# Altium schematic sheet 1.POWER.SchDoc
size A4
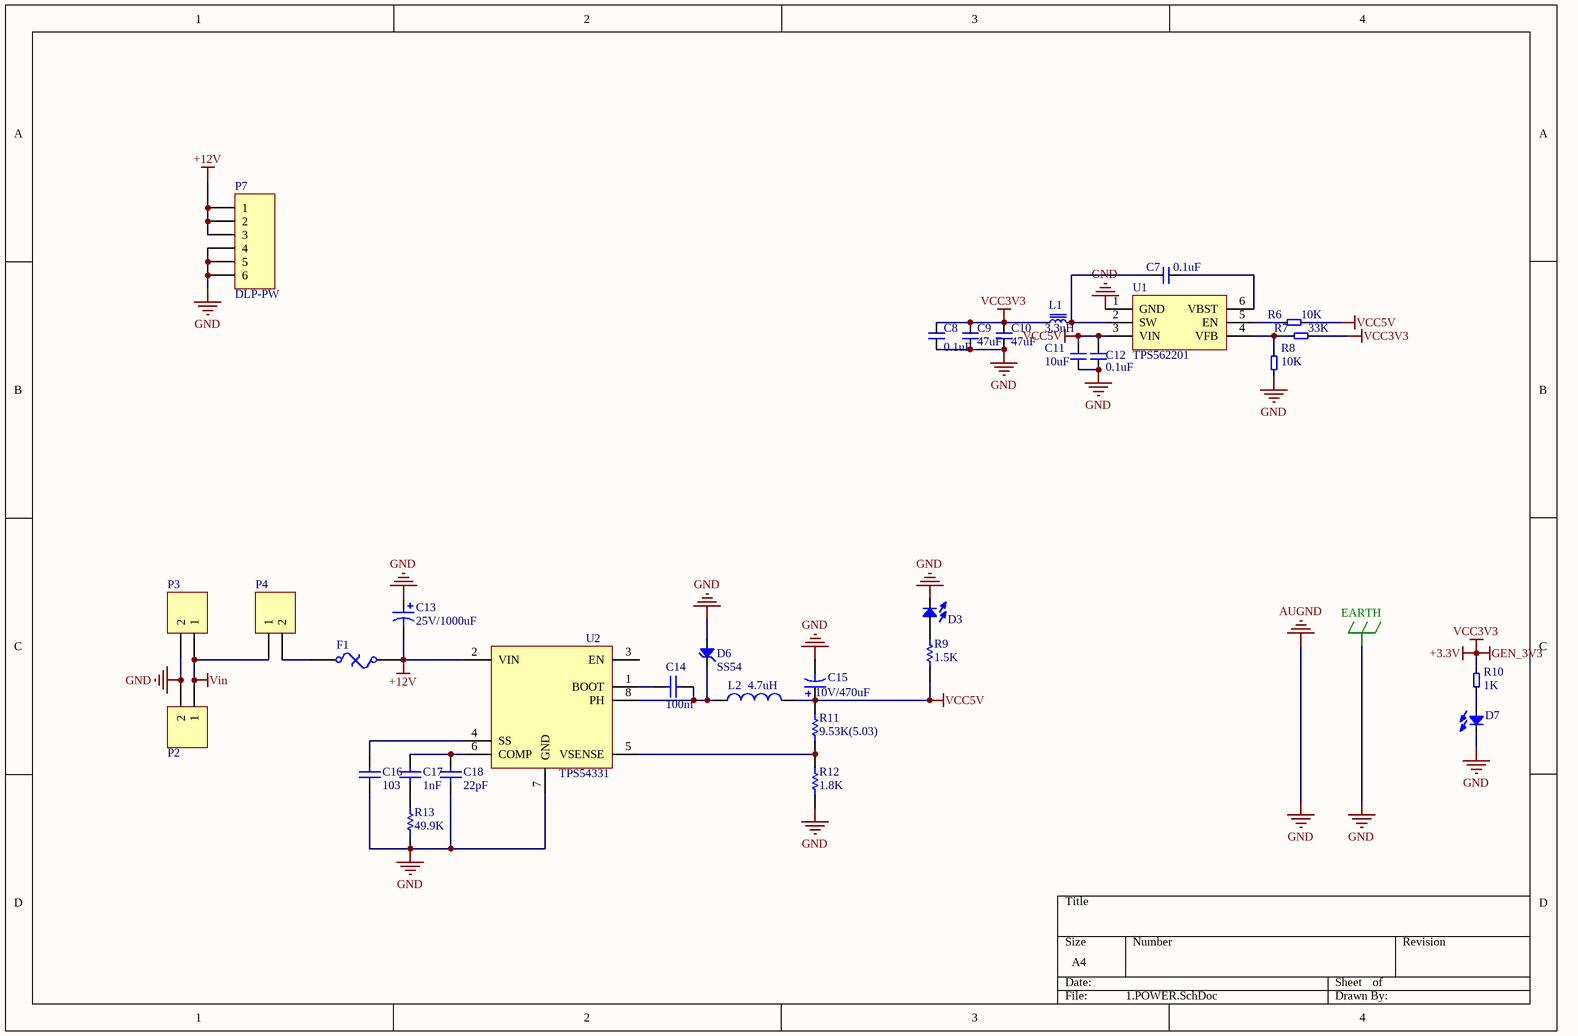
[diagram p0: 1.POWER.SchDoc]

## Parts
C7  0.1uF  [0603C]
C8  0.1uF  [0603C]
C9  47uF  [C1206]
C10  47uF  [C1206]
C11  10uF  [0603C]
C12  0.1uF  [0603C]
C13  value 25V/1000uF  [C10x5]  (hidden comment: Cap Pol3)
C14  value 100nf  [0603C]  (hidden comment: Cap)
C15  value 10V/470uF  [C8x4]  (hidden comment: Cap Pol3)
C16  value 103  [0603C]  (hidden comment: Cap)
C17  value 1nF  [0603C]  (hidden comment: Cap)
C18  value 22pF  [0603C]  (hidden comment: Cap)
D3  发光二极管  [0603D]  (value not drawn)
D6  SS54  [SMA]
D7  发光二极管  [0603D]  (value not drawn)
F1  Fuse Thermal  [1812F]  (value not drawn)
L1  3.3uH  [L4030]
L2  value 4.7uH  [L-6045]  (hidden comment: Inductor)
P2  Header 2  [XH2.54-2P]  (value not drawn)
P3  Header 2  [DC005]  (value not drawn)
P4  Header 2  [HDR1X2]  (value not drawn)
P7  DLP-PW  [SH1.0-6P]
R6  10K  [0603R]
R7  33K  [0603R]
R8  10K  [0603R]
R9  value 1.5K  [0603R]  (hidden comment: Res1)
R10  1K  [0603R]
R11  value 9.53K(5.03)  [0603R]  (hidden comment: Res Semi)
R12  value 1.8K  [0603R]  (hidden comment: Res Semi)
R13  value 49.9K  [0603R]  (hidden comment: Res Semi)
U1  TPS562201  [SOT23-6-DC]
U2  TPS54331  [SOP8-POW]

## Nets
+3.3V: C8.1 C9.1 C10.1 L1.1 R7.1 R10.2  [also labelled GEN_3V3, VCC3V3]
+12V: C13.2 F1.2 P7.1 P7.2 P7.3 U2.2(VIN)
AUGND: C8.2 C9.2 C10.2 C11.2 C12.2 C13.1 C15.2 C16.2 C18.1 D3.K D6.A D7.K P2.2 P3.2 P7.4 P7.5 P7.6 R8.1 R12.1 R13.1 U1.1(GND) U2.7(GND) U2.9(PAD)  [also labelled EARTH, GND]
VCC5V: C11.1 C12.1 C15.1 L2.2 R6.1 R9.1 R11.2 U1.3(VIN)
Vin: P2.1 P3.1 P4.1
NetC7_1: C7.1 L1.2 U1.2(SW)
NetC7_2: C7.2 U1.6(VBST)
NetC14_1: C14.1 D6.K L2.1 U2.8(PH)
NetC14_2: C14.2 U2.1(BOOT)
NetC16_1: C16.1 U2.4(SS)
NetC17_1: C17.1 R13.2
NetC17_2: C17.2 C18.2 U2.6(COMP)
NetD3_A: D3.A R9.2
NetD7_A: D7.A R10.1
NetF1_1: F1.1 P4.2
NetR6_2: R6.2 U1.5(EN)
NetR7_2: R7.2 R8.2 U1.4(VFB)
NetR11_1: R11.1 R12.2 U2.5(VSENSE)

Not connected (* = marked no-connect by the designer): U2 3(EN)

## Library data of the parts
C7-C12 = 电容
C13 C15 = Cap Pol3: Polarized Capacitor (Surface Mount); Published: 8-Jun-2000; LatestRevisionDate: 17-Jul-2002; LatestRevisionNote: Re-released for DXP Platform.; PackageReference: C0805; Publisher: Altium Limited
C14 C16-C18 = Cap: Capacitor; Published: 8-Jun-2000; LatestRevisionDate: 17-Jul-2002; LatestRevisionNote: Re-released for DXP Platform.; PackageReference: RAD-0.3; Publisher: Altium Limited
  C16-C18: PackageDescription: Radial Cap, Thru-Hole; 2 Leads; 0.3 in Pin Spacing
D6 = SS24: DIODES: *
F1 = Fuse Thermal: Thermal Fuse; Published: 24-Mar-1999; LatestRevisionDate: 17-Jul-2002; LatestRevisionNote: Re-released for DXP Platform.; PackageReference: PIN-W2/E2.8; Publisher: Altium Limited
L1 = 功率电感
L2 = Inductor: Code_IEC: 1005; Published: 8-Jun-2000; LatestRevisionDate: 17-Jul-2002; LatestRevisionNote: Re-released for DXP Platform.; PackageReference: 0402-A; Publisher: Altium Limited; Code_JEITA: 0402
P2-P4 = Header 2: Header, 2-Pin; LatestRevisionDate: 17-Jul-2002; LatestRevisionNote: Re-released for DXP Platform.; Publisher: Altium Limited
P7 = Header 6: Header, 6-Pin; LatestRevisionDate: 17-Jul-2002; LatestRevisionNote: Re-released for DXP Platform.; Publisher: Altium Limited
R6-R8 R10 = 电阻
R9 = Res1: Resistor; Published: 8-Jun-2000; LatestRevisionDate: 17-Jul-2002; LatestRevisionNote: Re-released for DXP Platform.; PackageReference: AXIAL-0.3; Publisher: Altium Limited
R11-R13 = Res Semi: Semiconductor Resistor; Published: 8-Jun-2000; LatestRevisionDate: 17-Jul-2002; LatestRevisionNote: Re-released for DXP Platform.; PackageReference: AXIAL-0.5; Publisher: Altium Limited; PackageDescription: Axial Device, Thru-Hole; 2 Leads; 0.5 in Pin Spacing